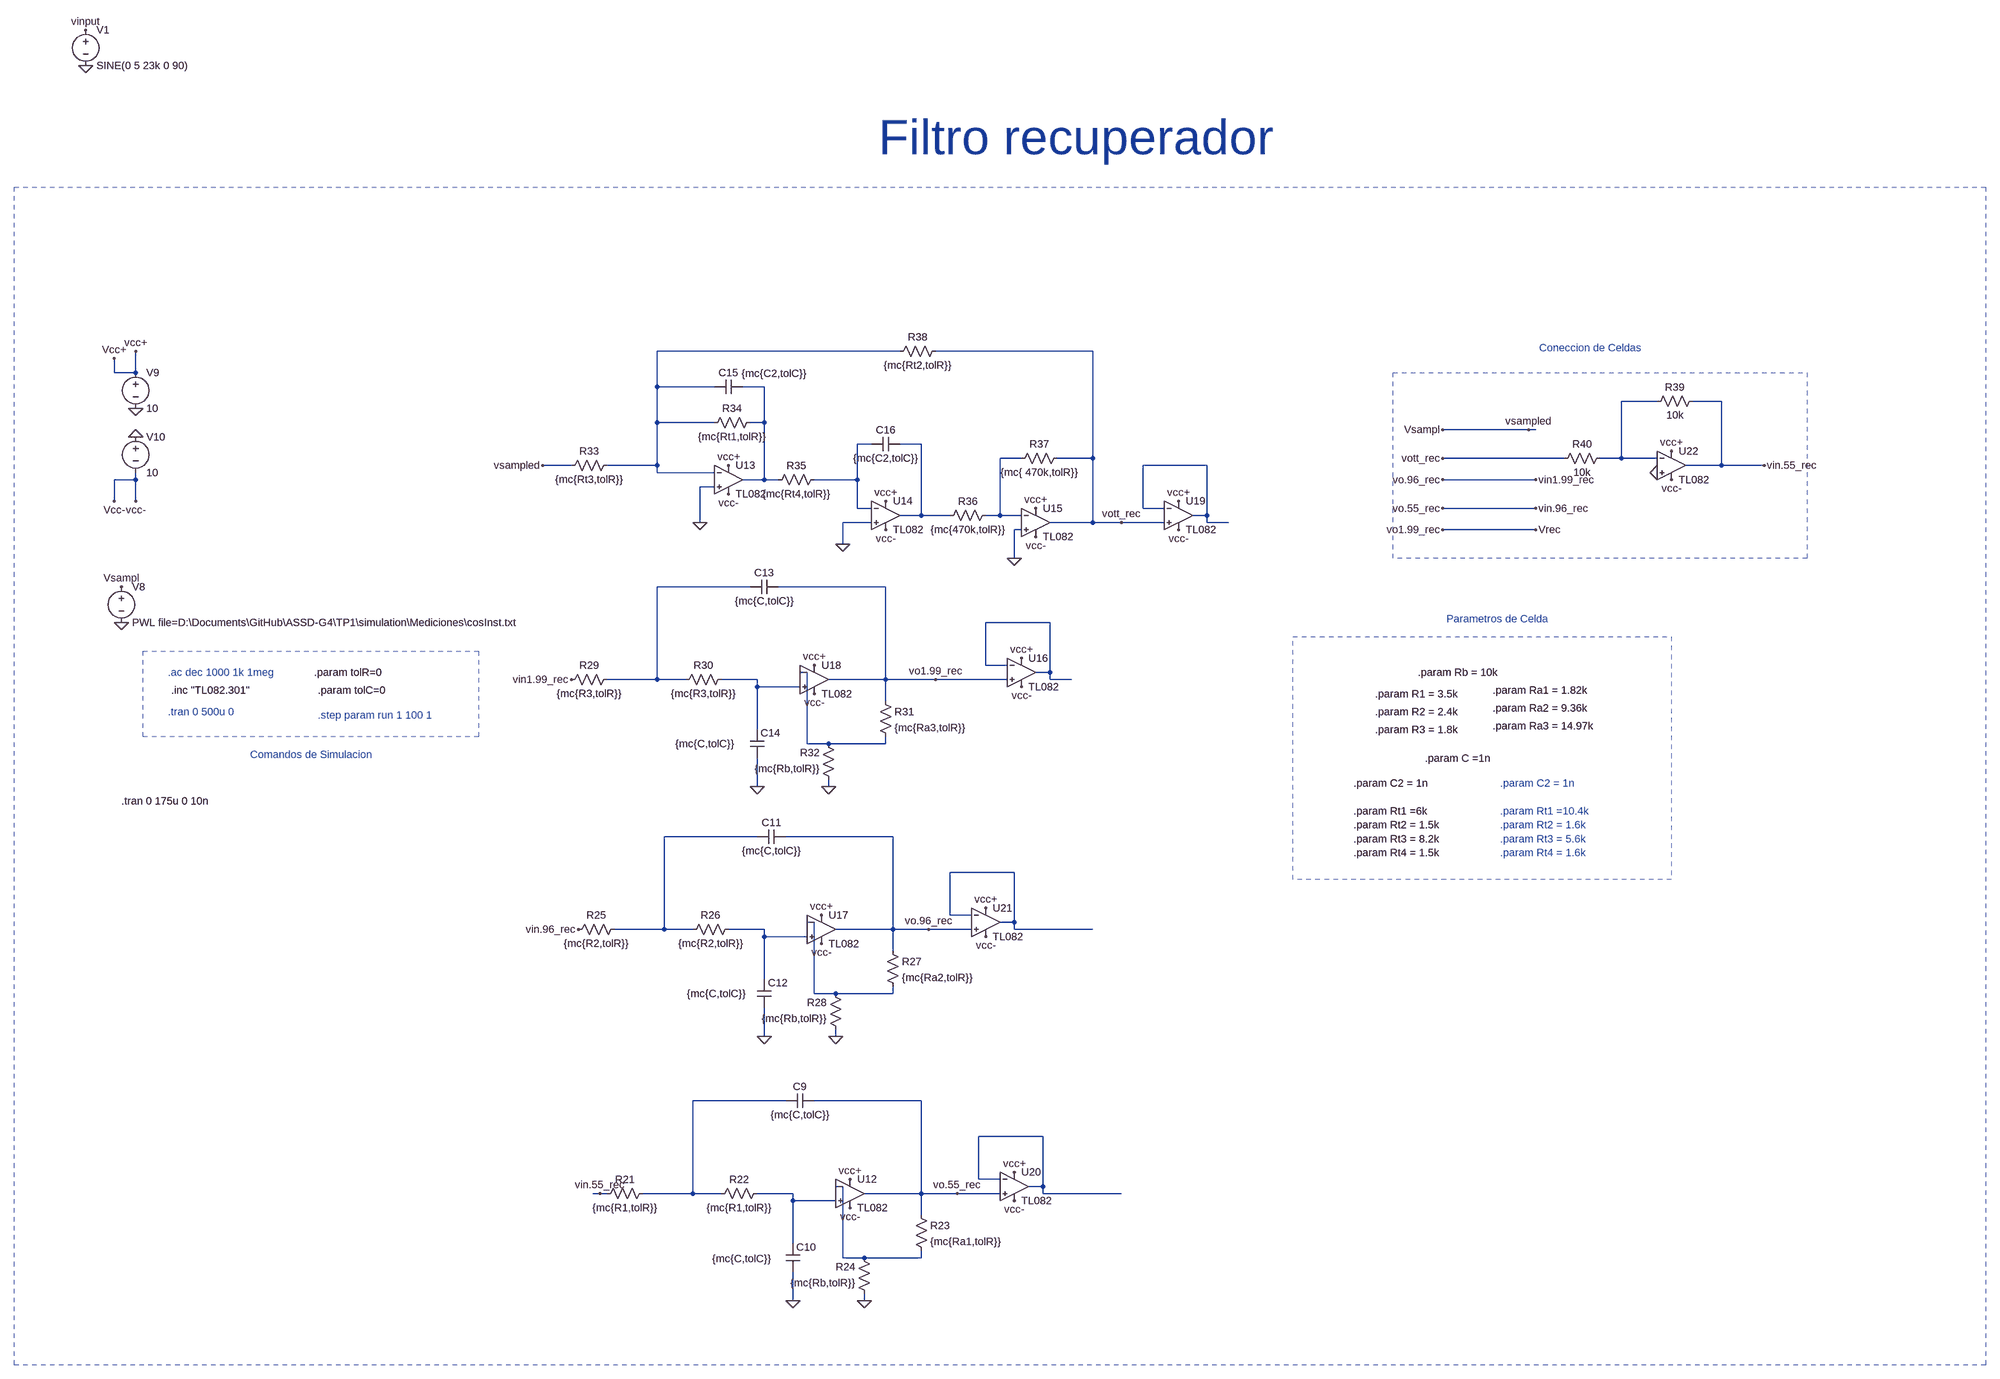
[diagram p0: schematic filter_rec.asc]
filter_rec.asc, the LTspice schematic file:
Version 4
SHEET 1 7044 1700
WIRE 4608 -576 4064 -576
WIRE 5040 -576 4688 -576
WIRE 2848 -528 2848 -560
WIRE 2896 -528 2896 -576
WIRE 2896 -528 2848 -528
WIRE 4064 -496 4064 -576
WIRE 4192 -496 4064 -496
WIRE 4304 -496 4256 -496
WIRE 6304 -464 6224 -464
WIRE 6448 -464 6384 -464
WIRE 4064 -416 4064 -496
WIRE 4192 -416 4064 -416
WIRE 4304 -416 4304 -496
WIRE 4304 -416 4272 -416
WIRE 6016 -400 5824 -400
WIRE 6032 -400 6016 -400
WIRE 4544 -368 4512 -368
WIRE 4656 -368 4608 -368
WIRE 4880 -336 4832 -336
WIRE 5040 -336 5040 -576
WIRE 5040 -336 4960 -336
WIRE 6096 -336 5824 -336
WIRE 6224 -336 6224 -464
WIRE 6224 -336 6176 -336
WIRE 6304 -336 6224 -336
WIRE 3872 -320 3808 -320
WIRE 4064 -320 4064 -416
WIRE 4064 -320 3952 -320
WIRE 5296 -320 5152 -320
WIRE 6448 -320 6448 -464
WIRE 6448 -320 6368 -320
WIRE 6544 -320 6448 -320
WIRE 4064 -304 4064 -320
WIRE 4192 -304 4064 -304
WIRE 2896 -288 2896 -304
WIRE 2896 -288 2848 -288
WIRE 4304 -288 4304 -416
WIRE 4304 -288 4256 -288
WIRE 4336 -288 4304 -288
WIRE 4512 -288 4512 -368
WIRE 4512 -288 4416 -288
WIRE 6032 -288 5824 -288
WIRE 4192 -272 4160 -272
WIRE 2848 -240 2848 -288
WIRE 2896 -240 2896 -288
WIRE 4512 -224 4512 -288
WIRE 4544 -224 4512 -224
WIRE 5152 -224 5152 -320
WIRE 5200 -224 5152 -224
WIRE 6032 -224 5824 -224
WIRE 4656 -208 4656 -368
WIRE 4656 -208 4608 -208
WIRE 4720 -208 4656 -208
WIRE 4832 -208 4832 -336
WIRE 4832 -208 4800 -208
WIRE 4880 -208 4832 -208
WIRE 5296 -208 5296 -320
WIRE 5296 -208 5264 -208
WIRE 4160 -192 4160 -272
WIRE 4544 -192 4480 -192
WIRE 5040 -192 5040 -336
WIRE 5040 -192 4944 -192
WIRE 5104 -192 5040 -192
WIRE 5200 -192 5104 -192
WIRE 5296 -192 5296 -208
WIRE 5344 -192 5296 -192
WIRE 4880 -176 4864 -176
WIRE 6032 -176 5824 -176
WIRE 4480 -144 4480 -192
WIRE 4864 -112 4864 -176
WIRE 4272 -48 4064 -48
WIRE 4576 -48 4336 -48
WIRE 4944 32 4800 32
WIRE 4800 128 4800 32
WIRE 4848 128 4800 128
WIRE 4400 144 4384 144
WIRE 4944 144 4944 32
WIRE 4944 144 4912 144
WIRE 4064 160 4064 -48
WIRE 4064 160 3952 160
WIRE 4128 160 4064 160
WIRE 4288 160 4208 160
WIRE 4576 160 4576 -48
WIRE 4576 160 4448 160
WIRE 4688 160 4576 160
WIRE 4848 160 4688 160
WIRE 4944 160 4944 144
WIRE 4992 160 4944 160
WIRE 4288 176 4288 160
WIRE 4384 176 4288 176
WIRE 4576 208 4576 160
WIRE 4288 272 4288 176
WIRE 4400 304 4400 144
WIRE 4448 304 4400 304
WIRE 4576 304 4576 288
WIRE 4576 304 4448 304
WIRE 4288 400 4288 336
WIRE 4448 400 4448 384
WIRE 4288 512 4080 512
WIRE 4592 512 4352 512
WIRE 4864 592 4720 592
WIRE 4720 688 4720 592
WIRE 4768 688 4720 688
WIRE 4416 704 4400 704
WIRE 4864 704 4864 592
WIRE 4864 704 4832 704
WIRE 4080 720 4080 512
WIRE 4080 720 3968 720
WIRE 4144 720 4080 720
WIRE 4304 720 4224 720
WIRE 4592 720 4592 512
WIRE 4592 720 4464 720
WIRE 4672 720 4592 720
WIRE 4768 720 4672 720
WIRE 4864 720 4864 704
WIRE 5040 720 4864 720
WIRE 4304 736 4304 720
WIRE 4400 736 4304 736
WIRE 4592 768 4592 720
WIRE 4304 832 4304 736
WIRE 4416 864 4416 704
WIRE 4464 864 4416 864
WIRE 4592 864 4592 848
WIRE 4592 864 4464 864
WIRE 4304 960 4304 896
WIRE 4464 960 4464 944
WIRE 4352 1104 4144 1104
WIRE 4656 1104 4416 1104
WIRE 4928 1184 4784 1184
WIRE 4784 1280 4784 1184
WIRE 4832 1280 4784 1280
WIRE 4480 1296 4464 1296
WIRE 4928 1296 4928 1184
WIRE 4928 1296 4896 1296
WIRE 3936 1312 3920 1312
WIRE 3952 1312 3936 1312
WIRE 4144 1312 4144 1104
WIRE 4144 1312 4032 1312
WIRE 4208 1312 4144 1312
WIRE 4368 1312 4288 1312
WIRE 4656 1312 4656 1104
WIRE 4656 1312 4528 1312
WIRE 4736 1312 4656 1312
WIRE 4832 1312 4736 1312
WIRE 4928 1312 4928 1296
WIRE 5104 1312 4928 1312
WIRE 4368 1328 4368 1312
WIRE 4464 1328 4368 1328
WIRE 4656 1360 4656 1312
WIRE 4368 1424 4368 1328
WIRE 4480 1456 4480 1296
WIRE 4528 1456 4480 1456
WIRE 4656 1456 4656 1440
WIRE 4656 1456 4528 1456
WIRE 4368 1552 4368 1488
WIRE 4528 1552 4528 1536
FLAG 4368 1552 0
FLAG 4528 1552 0
FLAG 4496 1280 vcc+
FLAG 4496 1344 vcc-
FLAG 4304 960 0
FLAG 4464 960 0
FLAG 4288 400 0
FLAG 4448 400 0
FLAG 4224 -320 vcc+
FLAG 4224 -256 vcc-
FLAG 4576 -240 vcc+
FLAG 4576 -176 vcc-
FLAG 4912 -224 vcc+
FLAG 4912 -160 vcc-
FLAG 4688 160 vo1.99_rec
FLAG 4160 -192 0
FLAG 4480 -144 0
FLAG 4864 -112 0
FLAG 4880 112 vcc+
FLAG 4880 176 vcc-
FLAG 4432 688 vcc+
FLAG 4432 752 vcc-
FLAG 4416 128 vcc+
FLAG 4416 192 vcc-
FLAG 5232 -240 vcc+
FLAG 5232 -176 vcc-
FLAG 3808 -320 vsampled
FLAG 4864 1264 vcc+
FLAG 4864 1328 vcc-
FLAG 4800 672 vcc+
FLAG 4800 736 vcc-
FLAG 5104 -192 vott_rec
FLAG 3872 160 vin1.99_rec
FLAG 3888 720 vin.96_rec
FLAG 4672 720 vo.96_rec
FLAG 3936 1312 vin.55_rec
FLAG 4736 1312 vo.55_rec
FLAG 5824 -400 Vsampl
FLAG 6016 -400 vsampled
FLAG 5824 -336 vott_rec
FLAG 6032 -224 vin.96_rec
FLAG 6544 -320 vin.55_rec
FLAG 5824 -288 vo.96_rec
FLAG 6032 -288 vin1.99_rec
FLAG 5824 -224 vo.55_rec
FLAG 5824 -176 vo1.99_rec
FLAG 6032 -176 Vrec
FLAG 6336 -352 vcc+
FLAG 6336 -288 vcc-
FLAG 6304 -304 0
FLAG 2864 32 0
FLAG 2864 -48 Vsampl
FLAG 2896 -448 0
FLAG 2896 -384 0
FLAG 2896 -576 vcc+
FLAG 2896 -240 vcc-
FLAG 2848 -560 Vcc+
FLAG 2848 -240 Vcc-
FLAG 2784 -1216 0
FLAG 2784 -1296 vinput
SYMBOL res 4048 1296 R90
WINDOW 0 0 56 VBottom 2
WINDOW 3 32 56 VTop 2
SYMATTR InstName R21
SYMATTR Value {mc{R1,tolR}}
SYMBOL res 4304 1296 R90
WINDOW 0 0 56 VBottom 2
WINDOW 3 32 56 VTop 2
SYMATTR InstName R22
SYMATTR Value {mc{R1,tolR}}
SYMBOL Opamps\\opamp2 4496 1248 R0
SYMATTR InstName U12
SYMATTR Value TL082
SYMBOL cap 4416 1088 R90
WINDOW 0 0 32 VBottom 2
WINDOW 3 32 32 VTop 2
SYMATTR InstName C9
SYMATTR Value {mc{C,tolC}}
SYMBOL cap 4352 1424 R0
WINDOW 3 -165 34 Left 2
SYMATTR Value {mc{C,tolC}}
SYMATTR InstName C10
SYMBOL res 4640 1344 R0
SYMATTR InstName R23
SYMATTR Value {mc{Ra1,tolR}}
SYMBOL res 4544 1552 R180
WINDOW 0 36 76 Left 2
WINDOW 3 36 40 Left 2
SYMATTR InstName R24
SYMATTR Value {mc{Rb,tolR}}
SYMBOL res 3984 704 R90
WINDOW 0 0 56 VBottom 2
WINDOW 3 32 56 VTop 2
SYMATTR InstName R25
SYMATTR Value {mc{R2,tolR}}
SYMBOL res 4240 704 R90
WINDOW 0 0 56 VBottom 2
WINDOW 3 32 56 VTop 2
SYMATTR InstName R26
SYMATTR Value {mc{R2,tolR}}
SYMBOL cap 4352 496 R90
WINDOW 0 0 32 VBottom 2
WINDOW 3 32 32 VTop 2
SYMATTR InstName C11
SYMATTR Value {mc{C,tolC}}
SYMBOL cap 4288 832 R0
WINDOW 3 -157 32 Left 2
SYMATTR Value {mc{C,tolC}}
SYMATTR InstName C12
SYMBOL res 4576 752 R0
SYMATTR InstName R27
SYMATTR Value {mc{Ra2,tolR}}
SYMBOL res 4480 960 R180
WINDOW 0 36 76 Left 2
WINDOW 3 36 40 Left 2
SYMATTR InstName R28
SYMATTR Value {mc{Rb,tolR}}
SYMBOL res 3968 144 R90
WINDOW 0 0 56 VBottom 2
WINDOW 3 32 56 VTop 2
SYMATTR InstName R29
SYMATTR Value {mc{R3,tolR}}
SYMBOL res 4224 144 R90
WINDOW 0 0 56 VBottom 2
WINDOW 3 32 56 VTop 2
SYMATTR InstName R30
SYMATTR Value {mc{R3,tolR}}
SYMBOL cap 4336 -64 R90
WINDOW 0 0 32 VBottom 2
WINDOW 3 32 32 VTop 2
SYMATTR InstName C13
SYMATTR Value {mc{C,tolC}}
SYMBOL cap 4272 272 R0
WINDOW 3 -167 32 Left 2
SYMATTR Value {mc{C,tolC}}
SYMATTR InstName C14
SYMBOL res 4560 192 R0
SYMATTR InstName R31
SYMATTR Value {mc{Ra3,tolR}}
SYMBOL res 4464 400 R180
WINDOW 0 36 76 Left 2
WINDOW 3 36 40 Left 2
SYMATTR InstName R32
SYMATTR Value {mc{Rb,tolR}}
SYMBOL Opamps\\opamp2 4224 -352 R0
SYMATTR InstName U13
SYMATTR Value TL082
SYMBOL Opamps\\opamp2 4576 -272 R0
SYMATTR InstName U14
SYMATTR Value TL082
SYMBOL Opamps\\opamp2 4912 -256 R0
SYMATTR InstName U15
SYMATTR Value TL082
SYMBOL res 3968 -336 R90
WINDOW 0 0 56 VBottom 2
WINDOW 3 32 56 VTop 2
SYMATTR InstName R33
SYMATTR Value {mc{Rt3,tolR}}
SYMBOL cap 4256 -512 R90
WINDOW 0 0 32 VBottom 2
WINDOW 3 -30 -70 VTop 2
SYMATTR InstName C15
SYMATTR Value {mc{C2,tolC}}
SYMBOL cap 4608 -384 R90
WINDOW 0 0 32 VBottom 2
WINDOW 3 32 32 VTop 2
SYMATTR InstName C16
SYMATTR Value {mc{C2,tolC}}
SYMBOL res 4288 -432 R90
WINDOW 0 0 56 VBottom 2
WINDOW 3 32 56 VTop 2
SYMATTR InstName R34
SYMATTR Value {mc{Rt1,tolR}}
SYMBOL res 4432 -304 R90
WINDOW 0 0 56 VBottom 2
WINDOW 3 32 56 VTop 2
SYMATTR InstName R35
SYMATTR Value {mc{Rt4,tolR}}
SYMBOL res 4816 -224 R90
WINDOW 0 0 56 VBottom 2
WINDOW 3 32 56 VTop 2
SYMATTR InstName R36
SYMATTR Value {mc{470k,tolR}}
SYMBOL res 4976 -352 R90
WINDOW 0 0 56 VBottom 2
WINDOW 3 32 56 VTop 2
SYMATTR InstName R37
SYMATTR Value {mc{ 470k,tolR}}
SYMBOL res 4704 -592 R90
WINDOW 0 0 56 VBottom 2
WINDOW 3 32 56 VTop 2
SYMATTR InstName R38
SYMATTR Value {mc{Rt2,tolR}}
SYMBOL Opamps\\opamp2 4880 80 R0
SYMATTR InstName U16
SYMATTR Value TL082
SYMBOL Opamps\\opamp2 4432 656 R0
SYMATTR InstName U17
SYMATTR Value TL082
SYMBOL Opamps\\opamp2 4416 96 R0
SYMATTR InstName U18
SYMATTR Value TL082
SYMBOL Opamps\\opamp2 5232 -272 R0
SYMATTR InstName U19
SYMATTR Value TL082
SYMBOL Opamps\\opamp2 4864 1232 R0
SYMATTR InstName U20
SYMATTR Value TL082
SYMBOL Opamps\\opamp2 4800 640 R0
SYMATTR InstName U21
SYMATTR Value TL082
SYMBOL Opamps\\opamp2 6336 -384 R0
SYMATTR InstName U22
SYMATTR Value TL082
SYMBOL res 6400 -480 R90
WINDOW 0 0 56 VBottom 2
WINDOW 3 32 56 VTop 2
SYMATTR InstName R39
SYMATTR Value 10k
SYMBOL res 6192 -352 R90
WINDOW 0 0 56 VBottom 2
WINDOW 3 32 56 VTop 2
SYMATTR InstName R40
SYMATTR Value 10k
SYMBOL voltage 2864 -64 R0
WINDOW 123 0 0 Left 0
WINDOW 39 0 0 Left 0
SYMATTR InstName V8
SYMATTR Value PWL file=D:\Documents\GitHub\ASSD-G4\TP1\simulation\Mediciones\cosInst.txt
SYMBOL voltage 2896 -544 R0
WINDOW 123 0 0 Left 0
WINDOW 39 0 0 Left 0
SYMATTR InstName V9
SYMATTR Value 10
SYMBOL voltage 2896 -400 R0
WINDOW 123 0 0 Left 0
WINDOW 39 0 0 Left 0
SYMATTR InstName V10
SYMATTR Value 10
SYMBOL voltage 2784 -1312 R0
WINDOW 123 0 0 Left 0
WINDOW 39 0 0 Left 0
SYMATTR InstName V1
SYMATTR Value SINE(0 5 23k 0 90)
TEXT 2864 432 Left 2 !.tran 0 175u 0 10n
TEXT 2968 144 Left 2 ;.ac dec 1000 1k 1meg
TEXT 2976 184 Left 2 !.inc "TL082.301"
TEXT 5768 144 Left 2 !.param Rb = 10k
TEXT 5672 192 Left 2 !.param R1 = 3.5k
TEXT 5936 184 Left 2 !.param Ra1 = 1.82k
TEXT 5672 232 Left 2 !.param R2 = 2.4k
TEXT 5936 224 Left 2 !.param Ra2 = 9.36k
TEXT 5672 272 Left 2 !.param R3 = 1.8k
TEXT 5936 264 Left 2 !.param Ra3 = 14.97k
TEXT 5784 336 Left 2 !.param C =1n
TEXT 3296 144 Left 2 !.param tolR=0
TEXT 3304 184 Left 2 !.param tolC=0
TEXT 3304 240 Left 2 ;.step param run 1 100 1
TEXT 5952 392 Left 2 ;.param C2 = 1n\n \n.param Rt1 =10.4k\n.param Rt2 = 1.6k\n.param Rt3 = 5.6k\n.param Rt4 = 1.6k
TEXT 2968 232 Left 2 ;.tran 0 500u 0
TEXT 5624 392 Left 2 !.param C2 = 1n\n \n.param Rt1 =6k\n.param Rt2 = 1.5k\n.param Rt3 = 8.2k\n.param Rt4 = 1.5k
TEXT 5832 24 Left 2 ;Parametros de Celda
TEXT 3152 328 Left 2 ;Comandos de Simulacion
TEXT 6040 -584 Left 2 ;Coneccion de Celdas
TEXT 4560 -1056 Left 7 ;Filtro recuperador
RECTANGLE Normal 7040 1696 2624 -944 1
RECTANGLE Normal 6336 608 5488 64 1
RECTANGLE Normal 3664 288 2912 96 1
RECTANGLE Normal 6640 -112 5712 -528 1

The netlist it stands for:
* filter_rec.asc
R21 N016 vin.55_rec {mc{R1,tolR}}
R22 N019 N016 {mc{R1,tolR}}
XU12 N019 N018 vcc+ vcc- vo.55_rec TL082  ; pins In+ In- V+ V- OUT
C9 vo.55_rec N016 {mc{C,tolC}}
C10 N019 0 {mc{C,tolC}}
R23 vo.55_rec N018 {mc{Ra1,tolR}}
R24 0 N018 {mc{Rb,tolR}}
R25 N012 vo.55_rec {mc{R2,tolR}}
R26 N015 N012 {mc{R2,tolR}}
C11 vo.96_rec N012 {mc{C,tolC}}
C12 N015 0 {mc{C,tolC}}
R27 vo.96_rec N014 {mc{Ra2,tolR}}
R28 0 N014 {mc{Rb,tolR}}
R29 N008 vo.96_rec {mc{R3,tolR}}
R30 N011 N008 {mc{R3,tolR}}
C13 Vrec N008 {mc{C,tolC}}
C14 N011 0 {mc{C,tolC}}
R31 Vrec N010 {mc{Ra3,tolR}}
R32 0 N010 {mc{Rb,tolR}}
XU13 0 N001 vcc+ vcc- N002 TL082  ; pins In+ In- V+ V- OUT
XU14 0 N004 vcc+ vcc- N005 TL082  ; pins In+ In- V+ V- OUT
XU15 0 N006 vcc+ vcc- vott_rec TL082  ; pins In+ In- V+ V- OUT
R33 N001 Vsampl {mc{Rt3,tolR}}
C15 N002 N001 {mc{C2,tolC}}
C16 N005 N004 {mc{C2,tolC}}
R34 N002 N001 {mc{Rt1,tolR}}
R35 N004 N002 {mc{Rt4,tolR}}
R36 N006 N005 {mc{470k,tolR}}
R37 vott_rec N006 {mc{ 470k,tolR}}
R38 vott_rec N001 {mc{Rt2,tolR}}
XU16 Vrec N009 vcc+ vcc- N009 TL082  ; pins In+ In- V+ V- OUT
XU17 N015 N014 vcc+ vcc- vo.96_rec TL082  ; pins In+ In- V+ V- OUT
XU18 N011 N010 vcc+ vcc- Vrec TL082  ; pins In+ In- V+ V- OUT
XU19 vott_rec N007 vcc+ vcc- N007 TL082  ; pins In+ In- V+ V- OUT
XU20 vo.55_rec N017 vcc+ vcc- N017 TL082  ; pins In+ In- V+ V- OUT
XU21 vo.96_rec N013 vcc+ vcc- N013 TL082  ; pins In+ In- V+ V- OUT
XU22 0 N003 vcc+ vcc- vin.55_rec TL082  ; pins In+ In- V+ V- OUT
R39 vin.55_rec N003 10k
R40 N003 vott_rec 10k
V8 Vsampl 0 PWL file=D:\Documents\GitHub\ASSD-G4\TP1\simulation\Mediciones\cosInst.txt
V9 vcc+ 0 10
V10 0 vcc- 10
V1 vinput 0 SINE(0 5 23k 0 90)
.tran 0 175u 0 10n
* .ac dec 1000 1k 1meg
.inc "TL082.301"
.param Rb = 10k
.param R1 = 3.5k
.param Ra1 = 1.82k
.param R2 = 2.4k
.param Ra2 = 9.36k
.param R3 = 1.8k
.param Ra3 = 14.97k
.param C =1n
.param tolR=0
.param tolC=0
* .step param run 1 100 1
* .param C2 = 1n
* .param Rt1 =10.4k
* .param Rt2 = 1.6k
* .param Rt3 = 5.6k
* .param Rt4 = 1.6k
* .tran 0 500u 0
.param C2 = 1n
.param Rt1 =6k
.param Rt2 = 1.5k
.param Rt3 = 8.2k
.param Rt4 = 1.5k
* Parametros de Celda
* Comandos de Simulacion
* Coneccion de Celdas
* Filtro recuperador
.backanno
.end